# Altium schematic sheet 接口.SchDoc
size A4
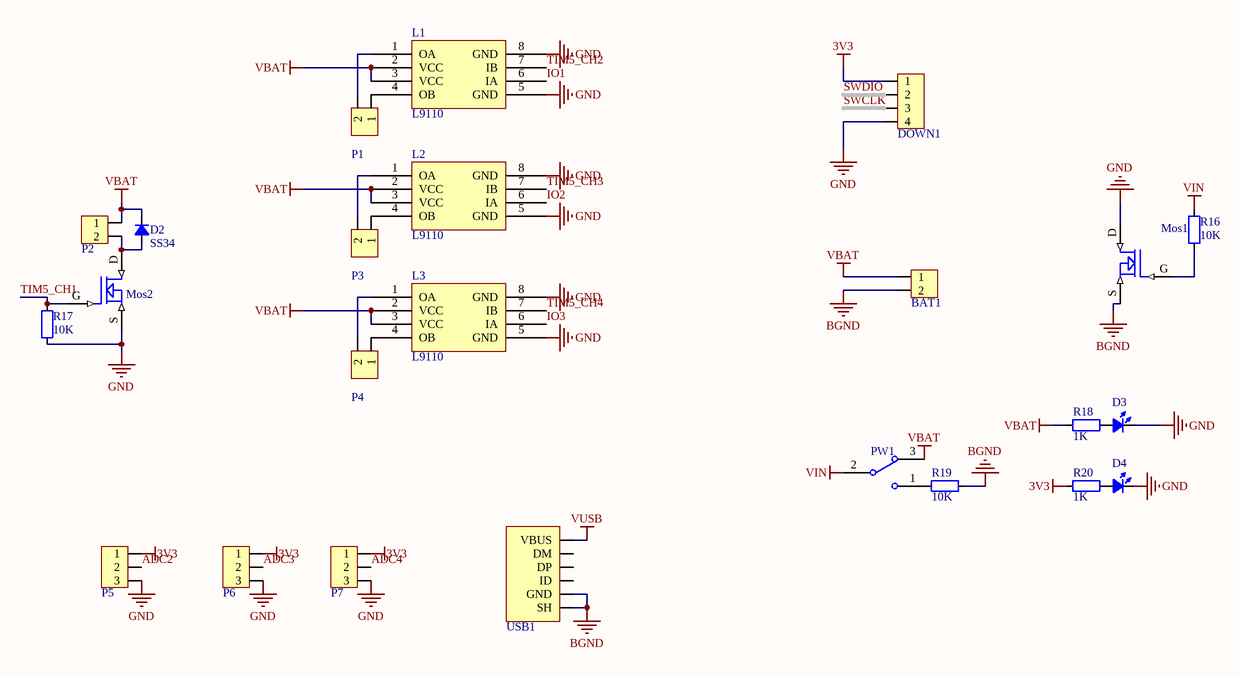
[diagram p0: 接口.SchDoc]

## Parts
BAT1  HDR1x2_2.54  [HDR1X2_2.54_90]  (value not drawn)
D2  value SS34  [DO-214AC]  (hidden comment: Diode_SMA)
D3  LED_0805  [LED_0805_YELLOW]  (value not drawn)
D4  LED_0805  [LED_0805_YELLOW]  (value not drawn)
DOWN1  HDR1x4_2.54  [HDR1X4_2.54_180]  (value not drawn)
L1  L9110  [SOP_E150_8]
L2  L9110  [SOP_E150_8]
L3  L9110  [SOP_E150_8]
Mos1  MOSFET N  [Nmos_SOT23]  (value not drawn)
Mos2  MOSFET N  [Nmos_SOT23]  (value not drawn)
P1  HDR1x2_2.54  [HDR1X2_2.54_180]  (value not drawn)
P2  HDR1x2_2.54  [HDR1X2_2.54_180]  (value not drawn)
P3  HDR1x2_2.54  [HDR1X2_2.54_180]  (value not drawn)
P4  HDR1x2_2.54  [HDR1X2_2.54_180]  (value not drawn)
P5  HDR1x3_2.54  [HDR1X3_2.54_180]  (value not drawn)
P6  HDR1x3_2.54  [HDR1X3_2.54_180]  (value not drawn)
P7  HDR1x3_2.54  [HDR1X3_2.54_180]  (value not drawn)
PW1  SwitchSPDT_2.8x6.6_90  [SwitchSPDT_2.8X6.6_90]  (value not drawn)
R16  value 10K  [RES_0603]  (hidden comment: Res_0603)
R17  value 10K  [RES_0603]  (hidden comment: Res_0603)
R18  value 1K  [RES_0603]  (hidden comment: Res_0603)
R19  value 10K  [RES_0603]  (hidden comment: Res_0603)
R20  value 1K  [RES_0603]  (hidden comment: Res_0603)
USB1  USB_Micro  [USB_Micro-AB]  (value not drawn)

## Nets
3V3: DOWN1.1 P5.1 P6.1 P7.1 R20.1
BGND: BAT1.2 Mos1.S R19.2 USB1.0(SH) USB1.5(GND)
GND: D3.2(K) D4.2(K) DOWN1.4 L1.5(GND) L1.8(GND) L2.5(GND) L2.8(GND) L3.5(GND) L3.8(GND) Mos1.D Mos2.S P5.3 P6.3 P7.3 R17.1
VBAT: BAT1.1 D2.2(K) L1.2(VCC) L1.3(VCC) L2.2(VCC) L2.3(VCC) L3.2(VCC) L3.3(VCC) P2.1 PW1.3 R18.1
VIN: PW1.2 R16.2
VUSB: USB1.1(VBUS)
ADC2: P5.2
ADC3: P6.2
ADC4: P7.2
IO1: L1.6(IA)
IO2: L2.6(IA)
IO3: L3.6(IA)
SWCLK: DOWN1.3
SWDIO: DOWN1.2
TIM5_CH1: Mos2.G R17.2
TIM5_CH2: L1.7(IB)
TIM5_CH3: L2.7(IB)
TIM5_CH4: L3.7(IB)
NetD2_1: D2.1(A) Mos2.D P2.2
NetD3_1: D3.1(A) R18.2
NetD4_1: D4.1(A) R20.2
NetL1_1: L1.1(OA) P1.2
NetL1_4: L1.4(OB) P1.1
NetL2_1: L2.1(OA) P3.2
NetL2_4: L2.4(OB) P3.1
NetL3_1: L3.1(OA) P4.2
NetL3_4: L3.4(OB) P4.1
NetMos1_G: Mos1.G R16.1
NetPW1_1: PW1.1 R19.1

Not connected (* = marked no-connect by the designer): USB1 2(DM) 3(DP) 4(ID)

## Library data of the parts
BAT1 P1 P3 P4 = HDR1x2_2.54: Header
D2 = Diode_SMA: Diode
D3 D4 = LED_0805: LED
DOWN1 = HDR1x4_2.54: Header
Mos1 Mos2 = MOSFET N: MOS SOT23
P2 = HDR1x2_2.54T: Header
P5-P7 = HDR1x3_2.54T: Header
PW1 = SwitchSPDT_2.8x6.6_90: Switch
R16-R20 = Res_0603: Resistor
USB1 = USB_Micro: USB